# Altium project AudioEqualizer.PrjPcb
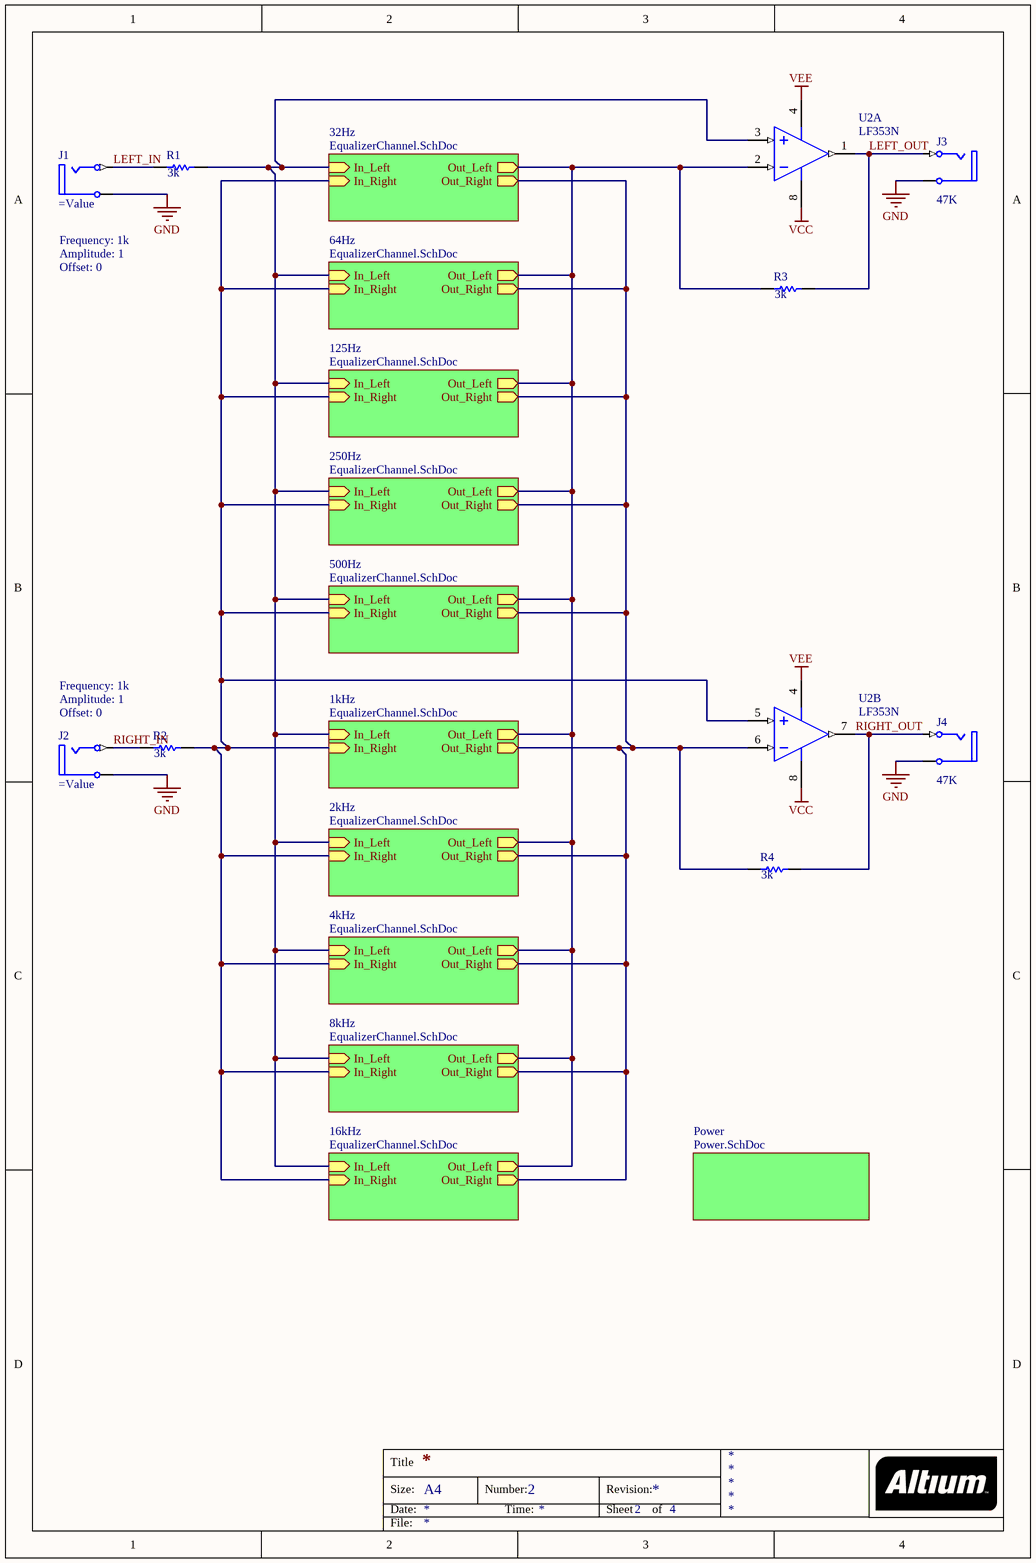
[diagram p0: EqualizerTop.SchDoc]
4 sheets, 139 parts. Net scope: hierarchical (ports join the sheet entries above them; power ports are global).
Sheets:
  EqualizerTop.SchDoc
    32Hz = EqualizerChannel.SchDoc
      Left = RCNetwork.SchDoc
      Right = RCNetwork.SchDoc
    64Hz = EqualizerChannel.SchDoc
      Left = RCNetwork.SchDoc
      Right = RCNetwork.SchDoc
    125Hz = EqualizerChannel.SchDoc
      Left = RCNetwork.SchDoc
      Right = RCNetwork.SchDoc
    250Hz = EqualizerChannel.SchDoc
      Left = RCNetwork.SchDoc
      Right = RCNetwork.SchDoc
    500Hz = EqualizerChannel.SchDoc
      Left = RCNetwork.SchDoc
      Right = RCNetwork.SchDoc
    1kHz = EqualizerChannel.SchDoc
      Left = RCNetwork.SchDoc
      Right = RCNetwork.SchDoc
    2kHz = EqualizerChannel.SchDoc
      Left = RCNetwork.SchDoc
      Right = RCNetwork.SchDoc
    4kHz = EqualizerChannel.SchDoc
      Left = RCNetwork.SchDoc
      Right = RCNetwork.SchDoc
    8kHz = EqualizerChannel.SchDoc
      Left = RCNetwork.SchDoc
      Right = RCNetwork.SchDoc
    16kHz = EqualizerChannel.SchDoc
      Left = RCNetwork.SchDoc
      Right = RCNetwork.SchDoc
    Power = Power.SchDoc

## Sheet EqualizerTop.SchDoc
size A4 portrait; DocumentNumber: 2; SheetNumber: 2; SheetTotal: 4

### Parts
J1  Offset: 0  Amplitude: 1  Frequency: 1k  [RCA/4.5-H2]
J2  Offset: 0  Amplitude: 1  Frequency: 1k  [RCA/4.5-H2]
J3  47K  [RCA/4.5-H2]
J4  47K  [RCA/4.5-H2]
R1  3k  [3216[1206]]
R2  3k  [3216[1206]]
R3  3k  [3216[1206]]
R4  3k  [3216[1206]]
U2  LF353N  [N08E]  (parts A,B of 2)

### Sub-sheets
1kHz = EqualizerChannel.SchDoc: In_Left (in), Out_Left (out), In_Right (in), Out_Right (out)  | C1_Value: 3.9nF; C2_Value: 0.22uF; R1_Value: 68k; R2_Value: 470; POT_SET: {SLIDER_1K}
2kHz = EqualizerChannel.SchDoc: In_Left (in), Out_Left (out), In_Right (in), Out_Right (out)  | C1_Value: 2nF; C2_Value: 0.1uF; R1_Value: 68k; R2_Value: 470; POT_SET: {SLIDER_2K}
4kHz = EqualizerChannel.SchDoc: In_Left (in), Out_Left (out), In_Right (in), Out_Right (out)  | C1_Value: 1.1nF; C2_Value: 0.056uF; R1_Value: 62k; R2_Value: 470; POT_SET: {SLIDER_4K}
8kHz = EqualizerChannel.SchDoc: In_Left (in), Out_Left (out), In_Right (in), Out_Right (out)  | C1_Value: 510pF; C2_Value: 0.022uF; R1_Value: 68k; R2_Value: 510; POT_SET: {SLIDER_8K}
16kHz = EqualizerChannel.SchDoc: In_Left (in), Out_Left (out), In_Right (in), Out_Right (out)  | C1_Value: 330pF; C2_Value: 0.012uF; R1_Value: 51k; R2_Value: 510; POT_SET: {SLIDER_16K}
32Hz = EqualizerChannel.SchDoc: In_Left (in), Out_Left (out), In_Right (in), Out_Right (out)  | C1_Value: 0.12uF; C2_Value: 4.7uF; R1_Value: 75k; R2_Value: 500; POT_SET: {SLIDER_32}
64Hz = EqualizerChannel.SchDoc: In_Left (in), Out_Left (out), In_Right (in), Out_Right (out)  | C1_Value: 0.056uF; C2_Value: 3.3uF; R1_Value: 68k; R2_Value: 510; POT_SET: {SLIDER_64}
125Hz = EqualizerChannel.SchDoc: In_Left (in), Out_Left (out), In_Right (in), Out_Right (out)  | C1_Value: 0.033uF; C2_Value: 1.5uF; R1_Value: 62k; R2_Value: 510; POT_SET: {SLIDER_125}
250Hz = EqualizerChannel.SchDoc: In_Left (in), Out_Left (out), In_Right (in), Out_Right (out)  | C1_Value: 0.015uF; C2_Value: 0.82uF; R1_Value: 68k; R2_Value: 470; POT_SET: {SLIDER_250}
500Hz = EqualizerChannel.SchDoc: In_Left (in), Out_Left (out), In_Right (in), Out_Right (out)  | C1_Value: 8.2nF; C2_Value: 0.39uF; R1_Value: 62k; R2_Value: 470; POT_SET: {SLIDER_500}
Power = Power.SchDoc: no entries

### Nets
GND: J1.1A(Ground) J2.1A(Ground) J3.1A(Ground) J4.1A(Ground)
VCC: U2.8(V+)
VEE: U2.4(V-)
LEFT_IN: J1.2B(Signal) R1.1
LEFT_OUT: J3.2B(Signal) R3.2 U2.1(OUTA)
RIGHT_IN: J2.2B(Signal) R2.1
RIGHT_OUT: J4.2B(Signal) R4.2 U2.7(OUTB)
NetR1_2: R1.2 U2.3(INA+) ; sheet 32Hz/In_Left, sheet 64Hz/In_Left, sheet 125Hz/In_Left, sheet 250Hz/In_Left, sheet 500Hz/In_Left, sheet 1kHz/In_Left, sheet 2kHz/In_Left, sheet 4kHz/In_Left, sheet 8kHz/In_Left, sheet 16kHz/In_Left
NetR2_2: R2.2 U2.5(INB+) ; sheet 32Hz/In_Right, sheet 64Hz/In_Right, sheet 125Hz/In_Right, sheet 250Hz/In_Right, sheet 500Hz/In_Right, sheet 1kHz/In_Right, sheet 2kHz/In_Right, sheet 4kHz/In_Right, sheet 8kHz/In_Right, sheet 16kHz/In_Right
NetR3_1: R3.1 U2.2(INA-) ; sheet 32Hz/Out_Left, sheet 64Hz/Out_Left, sheet 125Hz/Out_Left, sheet 250Hz/Out_Left, sheet 500Hz/Out_Left, sheet 1kHz/Out_Left, sheet 2kHz/Out_Left, sheet 4kHz/Out_Left, sheet 8kHz/Out_Left, sheet 16kHz/Out_Left
NetR4_1: R4.1 U2.6(INB-) ; sheet 32Hz/Out_Right, sheet 64Hz/Out_Right, sheet 125Hz/Out_Right, sheet 250Hz/Out_Right, sheet 500Hz/Out_Right, sheet 1kHz/Out_Right, sheet 2kHz/Out_Right, sheet 4kHz/Out_Right, sheet 8kHz/Out_Right, sheet 16kHz/Out_Right

### Notes on the sheet
- Title
- Size:
- Date:
- A4
- Number:
- Time:
- Revision:
- Sheet
- of
- File:

### Library data of the parts
J1-J4 = RCA: RCA Phono Jack, Right Angle, Thru-Hole, Snap-In; PCB_Layout: Complies with manufacturer's recommendation.; DrillAndSlotSize: Corresponds to nominal value.; Published: 15-Jul-2004; LatestRevisionDate: 15-Jul-2004; LatestRevisionNote: Component Replaced.; DatasheetDocument: 7-Jul-2000; PackageDocument: 7-Jul-2000; PackageReference: 161; Publisher: Altium Limited; ComponentLink1Description: Manufacturer Link; ComponentLink1URL: http://www.mouser.com/kobiconn/
  J3 J4: Value: 47K
R1-R4 = Res1: Resistor; Published: 8-Jun-2000; LatestRevisionDate: 17-Jul-2002; LatestRevisionNote: Re-released for DXP Platform.; Publisher: Altium Limited; Value: 3k
U2 = LF353N: Wide Bandwidth Dual JFET Input Operational Amplifier, 8-pin MDIP; Manufacturer: National Semiconductor; PackageTopMarking: NSUZXYTTE#*LF*353N; PowerWise: N; CompType: Amplifiers; Published: 4-Dec-2008; LatestRevisionDate: 13-Jan-2009; LatestRevisionNote: Sim Model Added.; PackageReference: N08E; Publisher: Altium Limited; ComponentLink1Description: LF353 Datasheet; ComponentLink1URL: http://www.national.com/ds/LF/LF353.pdf; ComponentLink2Description: LF353 Web Page; ComponentLink2URL: http://www.national.com/pf/LF/LF353.html; ComponentLink3Description: N08E Package Page; ComponentLink3URL: http://www.national.com/packaging/folders/n08e.html; DatasheetVersion: Dec-2003; PackageVersion: revG, May-2006; PackageDescription: MDIP, .365 x .250 x .130in, 8 Lead, .100in Pitch; Supplier 1: Farnell; Supplier Part Number 1: 9487034; PartNumber: LF353N; RoHS: N; PinCount: 8; Code_JEDEC: MS-001-BA

## Sheet EqualizerChannel.SchDoc
size A4; DocumentNumber: 1; SheetNumber: 1; SheetTotal: 4
Used 10 times, as channels 32Hz, 64Hz, 125Hz, 250Hz, 500Hz, 1kHz, 2kHz, 4kHz, 8kHz, 16kHz. Parts and nets are listed once, with the designators drawn on the sheet.
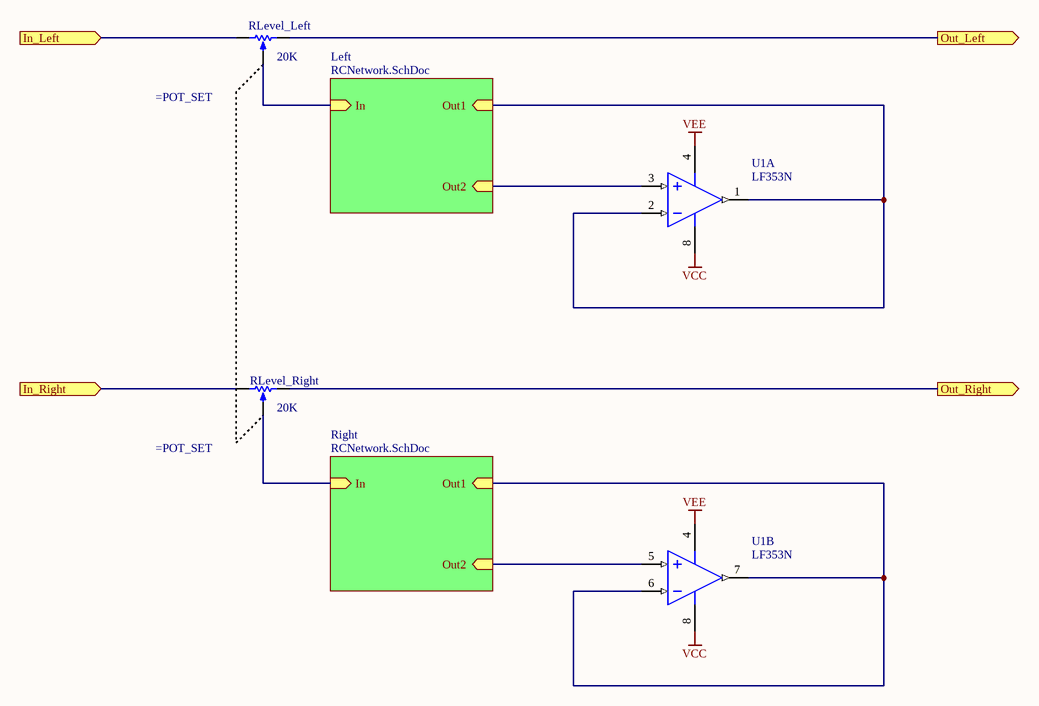
[diagram p1: EqualizerChannel.SchDoc]

### Parts
RLevel_Left  value 20K  [VR5]  (hidden comment: RPot)
RLevel_Right  value 20K  [VR5]  (hidden comment: RPot)
U1  LF353N  [N08E]  (parts A,B of 2)

### Sub-sheets
Left = RCNetwork.SchDoc: In (in), Out1 (in), Out2 (in)
Right = RCNetwork.SchDoc: In (in), Out1 (in), Out2 (in)

### Ports
In_Left (in), In_Right (in), Out_Left (out), Out_Right (out)

### Nets
VCC: U1.8(V+)
VEE: U1.4(V-)
In_Left: RLevel_Left.1(TOP) ; port In_Left
In_Right: RLevel_Right.1(TOP) ; port In_Right
Out_Left: RLevel_Left.2(BOT) ; port Out_Left
Out_Right: RLevel_Right.2(BOT) ; port Out_Right
NetRLevel_Left_3: RLevel_Left.3(TAP) ; sheet Left/In
NetRLevel_Right_3: RLevel_Right.3(TAP) ; sheet Right/In
NetU1_1: U1.1(OUTA) U1.2(INA-) ; sheet Left/Out1
NetU1_3: U1.3(INA+) ; sheet Left/Out2
NetU1_5: U1.5(INB+) ; sheet Right/Out2
NetU1_6: U1.6(INB-) U1.7(OUTB) ; sheet Right/Out1

### Channels
32Hz: designators end in _32Hz; ports In_Left=NetR1_2 In_Right=NetR2_2 Out_Left=NetR3_1 Out_Right=NetR4_1
64Hz: designators end in _64Hz; ports In_Left=NetR1_2 In_Right=NetR2_2 Out_Left=NetR3_1 Out_Right=NetR4_1
125Hz: designators end in _125Hz; ports In_Left=NetR1_2 In_Right=NetR2_2 Out_Left=NetR3_1 Out_Right=NetR4_1
250Hz: designators end in _250Hz; ports In_Left=NetR1_2 In_Right=NetR2_2 Out_Left=NetR3_1 Out_Right=NetR4_1
500Hz: designators end in _500Hz; ports In_Left=NetR1_2 In_Right=NetR2_2 Out_Left=NetR3_1 Out_Right=NetR4_1
1kHz: designators end in _1kHz; ports In_Left=NetR1_2 In_Right=NetR2_2 Out_Left=NetR3_1 Out_Right=NetR4_1
2kHz: designators end in _2kHz; ports In_Left=NetR1_2 In_Right=NetR2_2 Out_Left=NetR3_1 Out_Right=NetR4_1
4kHz: designators end in _4kHz; ports In_Left=NetR1_2 In_Right=NetR2_2 Out_Left=NetR3_1 Out_Right=NetR4_1
8kHz: designators end in _8kHz; ports In_Left=NetR1_2 In_Right=NetR2_2 Out_Left=NetR3_1 Out_Right=NetR4_1
16kHz: designators end in _16kHz; ports In_Left=NetR1_2 In_Right=NetR2_2 Out_Left=NetR3_1 Out_Right=NetR4_1

### Notes on the sheet
- Title
- Size:
- Date:
- A4
- Number:
- Time:
- Revision:
- Sheet
- of
- File:

### Library data of the parts
RLevel_Left RLevel_Right = RPot: Potentiometer; Sim Note: Enter the Resistance value and the set point into parameter fields.; Published: 8-Jun-2000; LatestRevisionDate: 17-Jul-2002; LatestRevisionNote: Re-released for DXP Platform.; Publisher: Altium Limited; Set Position: =POT_SET
U1 = LF353N: as U2 on sheet EqualizerTop; Published: 4-Dec-2008; LatestRevisionDate: 13-Jan-2009; LatestRevisionNote: Sim Model Added.; PackageReference: N08E; Publisher: Altium Limited; ComponentLink1Description: LF353 Datasheet; ComponentLink1URL: http://www.national.com/ds/LF/LF353.pdf; ComponentLink2Description: LF353 Web Page; ComponentLink2URL: http://www.national.com/pf/LF/LF353.html; ComponentLink3Description: N08E Package Page; ComponentLink3URL: http://www.national.com/packaging/folders/n08e.html; DatasheetVersion: Dec-2003; PackageVersion: revG, May-2006; PackageDescription: MDIP, .365 x .250 x .130in, 8 Lead, .100in Pitch; Supplier 1: Farnell; Supplier Part Number 1: 9487034; PartNumber: LF353N; RoHS: N; PinCount: 8; Code_JEDEC: MS-001-BA

## Sheet RCNetwork.SchDoc
size A4; DocumentNumber: 3; SheetNumber: 3; SheetTotal: 4
Used 20 times, as channels 32Hz/Left, 32Hz/Right, 64Hz/Left, 64Hz/Right, 125Hz/Left, 125Hz/Right, 250Hz/Left, 250Hz/Right, 500Hz/Left, 500Hz/Right, 1kHz/Left, 1kHz/Right, 2kHz/Left, 2kHz/Right, 4kHz/Left, 4kHz/Right, 8kHz/Left, 8kHz/Right, 16kHz/Left, 16kHz/Right. Parts and nets are listed once, with the designators drawn on the sheet.
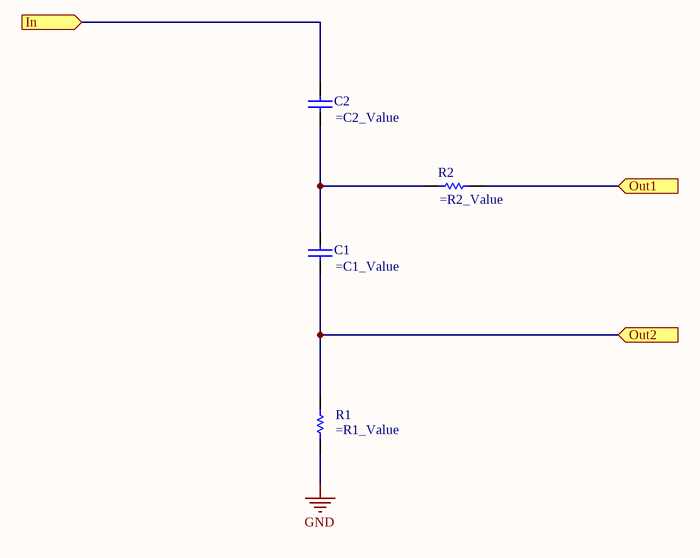
[diagram p2: RCNetwork.SchDoc]

### Parts
C1  (no value)  [C1206]
C2  (no value)  [C1206]
R1  (no value)  [3216[1206]]
R2  (no value)  [3216[1206]]

### Ports
In (in), Out1 (in), Out2 (in)

### Nets
GND: R1.1
In: C2.1 ; port In
Out1: R2.1 ; port Out1
Out2: C1.2 R1.2 ; port Out2
NetC1_1: C1.1 C2.2 R2.2

### Channels
32Hz/Left: designators end in _32Hz_Left; ports In=NetC2_32Hz_Left_1 Out1=NetR2_32Hz_Left_1 Out2=NetC1_32Hz_Left_2
32Hz/Right: designators end in _32Hz_Right; ports In=NetC2_32Hz_Right_1 Out1=NetR2_32Hz_Right_1 Out2=NetC1_32Hz_Right_2
64Hz/Left: designators end in _64Hz_Left; ports In=NetC2_64Hz_Left_1 Out1=NetR2_64Hz_Left_1 Out2=NetC1_64Hz_Left_2
64Hz/Right: designators end in _64Hz_Right; ports In=NetC2_64Hz_Right_1 Out1=NetR2_64Hz_Right_1 Out2=NetC1_64Hz_Right_2
125Hz/Left: designators end in _125Hz_Left; ports In=NetC2_125Hz_Left_1 Out1=NetR2_125Hz_Left_1 Out2=NetC1_125Hz_Left_2
125Hz/Right: designators end in _125Hz_Right; ports In=NetC2_125Hz_Right_1 Out1=NetR2_125Hz_Right_1 Out2=NetC1_125Hz_Right_2
250Hz/Left: designators end in _250Hz_Left; ports In=NetC2_250Hz_Left_1 Out1=NetR2_250Hz_Left_1 Out2=NetC1_250Hz_Left_2
250Hz/Right: designators end in _250Hz_Right; ports In=NetC2_250Hz_Right_1 Out1=NetR2_250Hz_Right_1 Out2=NetC1_250Hz_Right_2
500Hz/Left: designators end in _500Hz_Left; ports In=NetC2_500Hz_Left_1 Out1=NetR2_500Hz_Left_1 Out2=NetC1_500Hz_Left_2
500Hz/Right: designators end in _500Hz_Right; ports In=NetC2_500Hz_Right_1 Out1=NetR2_500Hz_Right_1 Out2=NetC1_500Hz_Right_2
1kHz/Left: designators end in _1kHz_Left; ports In=NetC2_1kHz_Left_1 Out1=NetR2_1kHz_Left_1 Out2=NetC1_1kHz_Left_2
1kHz/Right: designators end in _1kHz_Right; ports In=NetC2_1kHz_Right_1 Out1=NetR2_1kHz_Right_1 Out2=NetC1_1kHz_Right_2
2kHz/Left: designators end in _2kHz_Left; ports In=NetC2_2kHz_Left_1 Out1=NetR2_2kHz_Left_1 Out2=NetC1_2kHz_Left_2
2kHz/Right: designators end in _2kHz_Right; ports In=NetC2_2kHz_Right_1 Out1=NetR2_2kHz_Right_1 Out2=NetC1_2kHz_Right_2
4kHz/Left: designators end in _4kHz_Left; ports In=NetC2_4kHz_Left_1 Out1=NetR2_4kHz_Left_1 Out2=NetC1_4kHz_Left_2
4kHz/Right: designators end in _4kHz_Right; ports In=NetC2_4kHz_Right_1 Out1=NetR2_4kHz_Right_1 Out2=NetC1_4kHz_Right_2
8kHz/Left: designators end in _8kHz_Left; ports In=NetC2_8kHz_Left_1 Out1=NetR2_8kHz_Left_1 Out2=NetC1_8kHz_Left_2
8kHz/Right: designators end in _8kHz_Right; ports In=NetC2_8kHz_Right_1 Out1=NetR2_8kHz_Right_1 Out2=NetC1_8kHz_Right_2
16kHz/Left: designators end in _16kHz_Left; ports In=NetC2_16kHz_Left_1 Out1=NetR2_16kHz_Left_1 Out2=NetC1_16kHz_Left_2
16kHz/Right: designators end in _16kHz_Right; ports In=NetC2_16kHz_Right_1 Out1=NetR2_16kHz_Right_1 Out2=NetC1_16kHz_Right_2

### Notes on the sheet
- Title
- Size:
- Date:
- A4
- Number:
- Time:
- Revision:
- Sheet
- of
- File:

### Library data of the parts
C1 C2 = Cap: Capacitor; Published: 8-Jun-2000; LatestRevisionDate: 17-Jul-2002; LatestRevisionNote: Re-released for DXP Platform.; Publisher: Altium Limited
  C1: Value: =C1_Value
  C2: Value: =C2_Value
R1 R2 = Res1: Resistor; Published: 8-Jun-2000; LatestRevisionDate: 17-Jul-2002; LatestRevisionNote: Re-released for DXP Platform.; Publisher: Altium Limited
  R1: Value: =R1_Value
  R2: Value: =R2_Value

## Sheet Power.SchDoc
size A4; DocumentNumber: 4; SheetNumber: 4; SheetTotal: 4
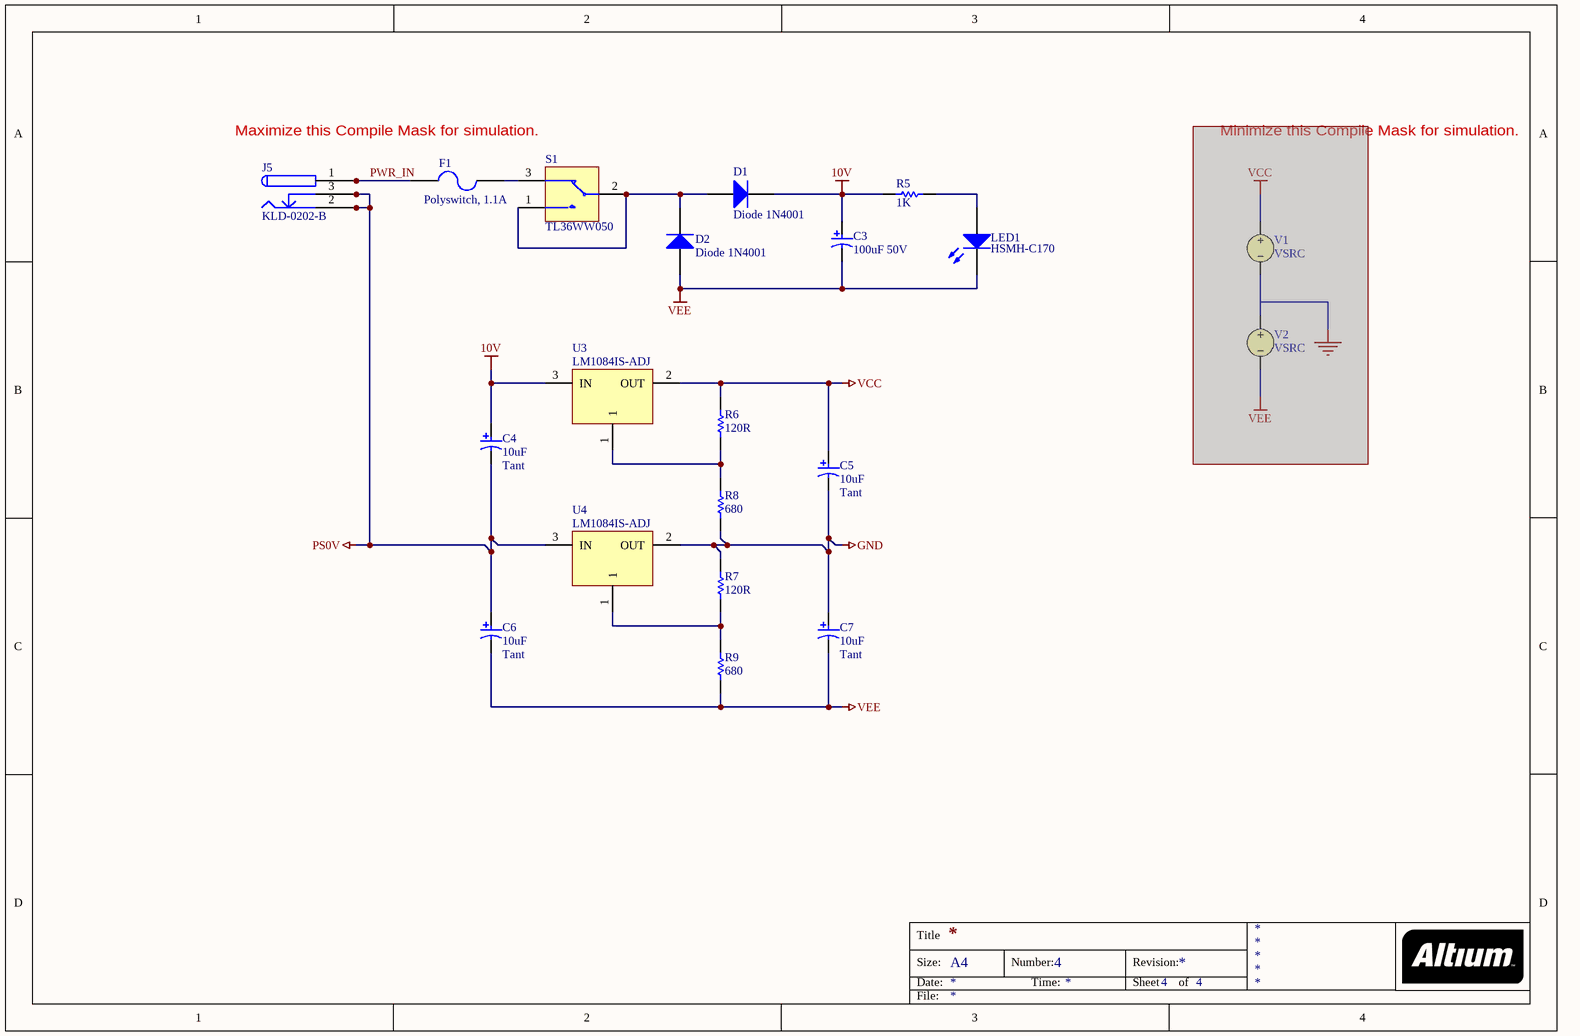
[diagram p3: Power.SchDoc]

### Parts
C3  100uF 50V  [MCCT-B]
C4  10uF  Capacitor Type: Tant  [MCCT-B]
C5  10uF  Capacitor Type: Tant  [MCCT-B]
C6  10uF  Capacitor Type: Tant  [MCCT-B]
C7  10uF  Capacitor Type: Tant  [MCCT-B]
D1  Diode 1N4001  [DO-41]
D2  Diode 1N4001  [DO-41]
F1  Polyswitch, 1.1A  [PIN-W2/E2.8]
J5  KLD-0202-B  [KLD-0202]
LED1  HSMH-C170  [SMD _LED]
R5  1K  [3216[1206]]
R6  120R  [3216[1206]]
R7  120R  [3216[1206]]
R8  680  [3216[1206]]
R9  680  [3216[1206]]
S1  TL36WW050  [B3FS_SWITCH]
U3  LM1084IS-ADJ  [TO-263]
U4  LM1084IS-ADJ  [TO-263]
V1  VSRC  (masked out: inside a compile mask, not in the netlist)
V2  VSRC  (masked out: inside a compile mask, not in the netlist)

### Nets
10V: C3.1 C4.1 D1.2(K) R5.2 U3.3(IN)
GND: C5.2 C7.1 R7.1 R8.2 U4.2(OUT)
PS0V: C4.2 C6.1 J5.2 J5.2A J5.2B J5.3 J5.3A J5.3B U4.3(IN)
VCC: C5.1 R6.1 U3.2(OUT)
VEE: C3.2 C6.2 C7.2 D2.1(A) LED1.2(K) R9.2
PWR_IN: F1.1 J5.1 J5.1A J5.1B
NetD1_1: D1.1(A) D2.2(K) S1.1 S1.2
NetF1_2: F1.2 S1.3
NetLED1_1: LED1.1(A) R5.1
NetR6_2: R6.2 R8.1 U3.1
NetR7_2: R7.2 R9.1 U4.1

### Notes on the sheet
- Maximize this Compile Mask for simulation.
- Minimize this Compile Mask for simulation.
- Title
- Size:
- Date:
- A4
- Number:
- Time:
- Revision:
- Sheet
- of
- File:

### Library data of the parts
C3 = CAP_POLAR: Polar Capacitor
C4-C7 = CAP_POLAR: Polar Capacitor; AEMS Code: 2100110; Supplier: FARNELL; Supplier Code: 967-117
D1 D2 = Diode 1N4001: 1 Amp General Purpose Rectifier; Published: 8-Jun-2000; LatestRevisionDate: 17-Jul-2002; LatestRevisionNote: Re-released for DXP Platform.; DatasheetVersion: 1998; PackageVersion: Aug-1999; PackageReference: DO-41; Publisher: Altium Limited; PackageDescription: Diode, Axial; Body 5.2 x 2.7 mm (LxDia. max), Lead Dia. 0.86 mm (max); Code_JEDEC: DO-204-AL; ComponentLink1Description: Manufacturer Link; ComponentLink1URL: http://www.fairchildsemi.com/; ComponentLink2Description: Datasheet; ComponentLink2URL: http://www.fairchildsemi.com/ds/1N%2F1N4001.pdf
F1 = Fuse 2: Polyswitch 1.1A, Raychem RUE110; Revision: July-2002: Re-released for DXP Platform.; Supplier: FARNELL; Supplier Code: 608-907
J5 = KLD-0202-B: Low Voltage Power Supply Connector; Manufacturer: Kycon; AEMS Code: 3510211
LED1 = HSMX-C670: Typical RED GaAs SMD LED Agilent make; AEMS Code: 2610081; Revision: July-2002: Re-released for DXP Platform.
R5 = RES: Resistor; AEMS Code: 1200430
R6-R9 = Res1: Resistor; Published: 8-Jun-2000; LatestRevisionDate: 17-Jul-2002; LatestRevisionNote: Re-released for DXP Platform.; Publisher: Altium Limited
  R6 R7: Value: 120R
  R8 R9: Value: 680
S1 = PCB_MOUNT_SWITCH: SPDT Subminiature Toggle Switch; Supplier: FARNELL; Supplier Code: 150-559
U3 U4 = LM1084IS-ADJ: 5A Low Dropout Possitive Regulators
V1 = VSRC: Voltage Source; Note: PCB Footprint - Not required; Value: 8V; Published: 8-Jun-2000; LatestRevisionDate: 17-Jul-2002; LatestRevisionNote: Re-released for DXP Platform.; PackageReference: Not Applicable; Publisher: Altium Limited
V2 = VSRC: Voltage Source; Note: PCB Footprint - Not required; Value: 8; Published: 8-Jun-2000; LatestRevisionDate: 17-Jul-2002; LatestRevisionNote: Re-released for DXP Platform.; PackageReference: Not Applicable; Publisher: Altium Limited

## Nets that join several sheets
GND: EqualizerTop (J1.1A J2.1A J3.1A J4.1A), 32Hz/Left (R1_32Hz_Left.1), 32Hz/Right (R1_32Hz_Right.1), 64Hz/Left (R1_64Hz_Left.1), 64Hz/Right (R1_64Hz_Right.1), 125Hz/Left (R1_125Hz_Left.1), 125Hz/Right (R1_125Hz_Right.1), 250Hz/Left (R1_250Hz_Left.1), 250Hz/Right (R1_250Hz_Right.1), 500Hz/Left (R1_500Hz_Left.1), 500Hz/Right (R1_500Hz_Right.1), 1kHz/Left (R1_1kHz_Left.1), 1kHz/Right (R1_1kHz_Right.1), 2kHz/Left (R1_2kHz_Left.1), 2kHz/Right (R1_2kHz_Right.1), 4kHz/Left (R1_4kHz_Left.1), 4kHz/Right (R1_4kHz_Right.1), 8kHz/Left (R1_8kHz_Left.1), 8kHz/Right (R1_8kHz_Right.1), 16kHz/Left (R1_16kHz_Left.1), 16kHz/Right (R1_16kHz_Right.1), Power (5 pins)
VCC: EqualizerTop (U2.8), 32Hz (U1_32Hz.8), 64Hz (U1_64Hz.8), 125Hz (U1_125Hz.8), 250Hz (U1_250Hz.8), 500Hz (U1_500Hz.8), 1kHz (U1_1kHz.8), 2kHz (U1_2kHz.8), 4kHz (U1_4kHz.8), 8kHz (U1_8kHz.8), 16kHz (U1_16kHz.8), Power (C5.1 R6.1 U3.2)
VEE: EqualizerTop (U2.4), 32Hz (U1_32Hz.4), 64Hz (U1_64Hz.4), 125Hz (U1_125Hz.4), 250Hz (U1_250Hz.4), 500Hz (U1_500Hz.4), 1kHz (U1_1kHz.4), 2kHz (U1_2kHz.4), 4kHz (U1_4kHz.4), 8kHz (U1_8kHz.4), 16kHz (U1_16kHz.4), Power (6 pins)
NetC1_1kHz_Left_2: 1kHz (U1_1kHz.3), 1kHz/Left (C1_1kHz_Left.2 R1_1kHz_Left.2)
NetC1_1kHz_Right_2: 1kHz (U1_1kHz.5), 1kHz/Right (C1_1kHz_Right.2 R1_1kHz_Right.2)
NetC1_2kHz_Left_2: 2kHz (U1_2kHz.3), 2kHz/Left (C1_2kHz_Left.2 R1_2kHz_Left.2)
NetC1_2kHz_Right_2: 2kHz (U1_2kHz.5), 2kHz/Right (C1_2kHz_Right.2 R1_2kHz_Right.2)
NetC1_4kHz_Left_2: 4kHz (U1_4kHz.3), 4kHz/Left (C1_4kHz_Left.2 R1_4kHz_Left.2)
NetC1_4kHz_Right_2: 4kHz (U1_4kHz.5), 4kHz/Right (C1_4kHz_Right.2 R1_4kHz_Right.2)
NetC1_8kHz_Left_2: 8kHz (U1_8kHz.3), 8kHz/Left (C1_8kHz_Left.2 R1_8kHz_Left.2)
NetC1_8kHz_Right_2: 8kHz (U1_8kHz.5), 8kHz/Right (C1_8kHz_Right.2 R1_8kHz_Right.2)
NetC1_16kHz_Left_2: 16kHz (U1_16kHz.3), 16kHz/Left (C1_16kHz_Left.2 R1_16kHz_Left.2)
NetC1_16kHz_Right_2: 16kHz (U1_16kHz.5), 16kHz/Right (C1_16kHz_Right.2 R1_16kHz_Right.2)
NetC1_32Hz_Left_2: 32Hz (U1_32Hz.3), 32Hz/Left (C1_32Hz_Left.2 R1_32Hz_Left.2)
NetC1_32Hz_Right_2: 32Hz (U1_32Hz.5), 32Hz/Right (C1_32Hz_Right.2 R1_32Hz_Right.2)
NetC1_64Hz_Left_2: 64Hz (U1_64Hz.3), 64Hz/Left (C1_64Hz_Left.2 R1_64Hz_Left.2)
NetC1_64Hz_Right_2: 64Hz (U1_64Hz.5), 64Hz/Right (C1_64Hz_Right.2 R1_64Hz_Right.2)
NetC1_125Hz_Left_2: 125Hz (U1_125Hz.3), 125Hz/Left (C1_125Hz_Left.2 R1_125Hz_Left.2)
NetC1_125Hz_Right_2: 125Hz (U1_125Hz.5), 125Hz/Right (C1_125Hz_Right.2 R1_125Hz_Right.2)
NetC1_250Hz_Left_2: 250Hz (U1_250Hz.3), 250Hz/Left (C1_250Hz_Left.2 R1_250Hz_Left.2)
NetC1_250Hz_Right_2: 250Hz (U1_250Hz.5), 250Hz/Right (C1_250Hz_Right.2 R1_250Hz_Right.2)
NetC1_500Hz_Left_2: 500Hz (U1_500Hz.3), 500Hz/Left (C1_500Hz_Left.2 R1_500Hz_Left.2)
NetC1_500Hz_Right_2: 500Hz (U1_500Hz.5), 500Hz/Right (C1_500Hz_Right.2 R1_500Hz_Right.2)
NetC2_1kHz_Left_1: 1kHz (RLevel_Left_1kHz.3), 1kHz/Left (C2_1kHz_Left.1)
NetC2_1kHz_Right_1: 1kHz (RLevel_Right_1kHz.3), 1kHz/Right (C2_1kHz_Right.1)
NetC2_2kHz_Left_1: 2kHz (RLevel_Left_2kHz.3), 2kHz/Left (C2_2kHz_Left.1)
NetC2_2kHz_Right_1: 2kHz (RLevel_Right_2kHz.3), 2kHz/Right (C2_2kHz_Right.1)
NetC2_4kHz_Left_1: 4kHz (RLevel_Left_4kHz.3), 4kHz/Left (C2_4kHz_Left.1)
NetC2_4kHz_Right_1: 4kHz (RLevel_Right_4kHz.3), 4kHz/Right (C2_4kHz_Right.1)
NetC2_8kHz_Left_1: 8kHz (RLevel_Left_8kHz.3), 8kHz/Left (C2_8kHz_Left.1)
NetC2_8kHz_Right_1: 8kHz (RLevel_Right_8kHz.3), 8kHz/Right (C2_8kHz_Right.1)
NetC2_16kHz_Left_1: 16kHz (RLevel_Left_16kHz.3), 16kHz/Left (C2_16kHz_Left.1)
NetC2_16kHz_Right_1: 16kHz (RLevel_Right_16kHz.3), 16kHz/Right (C2_16kHz_Right.1)
NetC2_32Hz_Left_1: 32Hz (RLevel_Left_32Hz.3), 32Hz/Left (C2_32Hz_Left.1)
NetC2_32Hz_Right_1: 32Hz (RLevel_Right_32Hz.3), 32Hz/Right (C2_32Hz_Right.1)
NetC2_64Hz_Left_1: 64Hz (RLevel_Left_64Hz.3), 64Hz/Left (C2_64Hz_Left.1)
NetC2_64Hz_Right_1: 64Hz (RLevel_Right_64Hz.3), 64Hz/Right (C2_64Hz_Right.1)
NetC2_125Hz_Left_1: 125Hz (RLevel_Left_125Hz.3), 125Hz/Left (C2_125Hz_Left.1)
NetC2_125Hz_Right_1: 125Hz (RLevel_Right_125Hz.3), 125Hz/Right (C2_125Hz_Right.1)
NetC2_250Hz_Left_1: 250Hz (RLevel_Left_250Hz.3), 250Hz/Left (C2_250Hz_Left.1)
NetC2_250Hz_Right_1: 250Hz (RLevel_Right_250Hz.3), 250Hz/Right (C2_250Hz_Right.1)
NetC2_500Hz_Left_1: 500Hz (RLevel_Left_500Hz.3), 500Hz/Left (C2_500Hz_Left.1)
NetC2_500Hz_Right_1: 500Hz (RLevel_Right_500Hz.3), 500Hz/Right (C2_500Hz_Right.1)
NetR1_2: EqualizerTop (R1.2 U2.3), 32Hz (RLevel_Left_32Hz.1), 64Hz (RLevel_Left_64Hz.1), 125Hz (RLevel_Left_125Hz.1), 250Hz (RLevel_Left_250Hz.1), 500Hz (RLevel_Left_500Hz.1), 1kHz (RLevel_Left_1kHz.1), 2kHz (RLevel_Left_2kHz.1), 4kHz (RLevel_Left_4kHz.1), 8kHz (RLevel_Left_8kHz.1), 16kHz (RLevel_Left_16kHz.1)
NetR2_1kHz_Left_1: 1kHz (U1_1kHz.1 U1_1kHz.2), 1kHz/Left (R2_1kHz_Left.1)
NetR2_1kHz_Right_1: 1kHz (U1_1kHz.6 U1_1kHz.7), 1kHz/Right (R2_1kHz_Right.1)
NetR2_2: EqualizerTop (R2.2 U2.5), 32Hz (RLevel_Right_32Hz.1), 64Hz (RLevel_Right_64Hz.1), 125Hz (RLevel_Right_125Hz.1), 250Hz (RLevel_Right_250Hz.1), 500Hz (RLevel_Right_500Hz.1), 1kHz (RLevel_Right_1kHz.1), 2kHz (RLevel_Right_2kHz.1), 4kHz (RLevel_Right_4kHz.1), 8kHz (RLevel_Right_8kHz.1), 16kHz (RLevel_Right_16kHz.1)
NetR2_2kHz_Left_1: 2kHz (U1_2kHz.1 U1_2kHz.2), 2kHz/Left (R2_2kHz_Left.1)
NetR2_2kHz_Right_1: 2kHz (U1_2kHz.6 U1_2kHz.7), 2kHz/Right (R2_2kHz_Right.1)
NetR2_4kHz_Left_1: 4kHz (U1_4kHz.1 U1_4kHz.2), 4kHz/Left (R2_4kHz_Left.1)
NetR2_4kHz_Right_1: 4kHz (U1_4kHz.6 U1_4kHz.7), 4kHz/Right (R2_4kHz_Right.1)
NetR2_8kHz_Left_1: 8kHz (U1_8kHz.1 U1_8kHz.2), 8kHz/Left (R2_8kHz_Left.1)
NetR2_8kHz_Right_1: 8kHz (U1_8kHz.6 U1_8kHz.7), 8kHz/Right (R2_8kHz_Right.1)
NetR2_16kHz_Left_1: 16kHz (U1_16kHz.1 U1_16kHz.2), 16kHz/Left (R2_16kHz_Left.1)
NetR2_16kHz_Right_1: 16kHz (U1_16kHz.6 U1_16kHz.7), 16kHz/Right (R2_16kHz_Right.1)
NetR2_32Hz_Left_1: 32Hz (U1_32Hz.1 U1_32Hz.2), 32Hz/Left (R2_32Hz_Left.1)
NetR2_32Hz_Right_1: 32Hz (U1_32Hz.6 U1_32Hz.7), 32Hz/Right (R2_32Hz_Right.1)
NetR2_64Hz_Left_1: 64Hz (U1_64Hz.1 U1_64Hz.2), 64Hz/Left (R2_64Hz_Left.1)
NetR2_64Hz_Right_1: 64Hz (U1_64Hz.6 U1_64Hz.7), 64Hz/Right (R2_64Hz_Right.1)
NetR2_125Hz_Left_1: 125Hz (U1_125Hz.1 U1_125Hz.2), 125Hz/Left (R2_125Hz_Left.1)
NetR2_125Hz_Right_1: 125Hz (U1_125Hz.6 U1_125Hz.7), 125Hz/Right (R2_125Hz_Right.1)
NetR2_250Hz_Left_1: 250Hz (U1_250Hz.1 U1_250Hz.2), 250Hz/Left (R2_250Hz_Left.1)
NetR2_250Hz_Right_1: 250Hz (U1_250Hz.6 U1_250Hz.7), 250Hz/Right (R2_250Hz_Right.1)
NetR2_500Hz_Left_1: 500Hz (U1_500Hz.1 U1_500Hz.2), 500Hz/Left (R2_500Hz_Left.1)
NetR2_500Hz_Right_1: 500Hz (U1_500Hz.6 U1_500Hz.7), 500Hz/Right (R2_500Hz_Right.1)
NetR3_1: EqualizerTop (R3.1 U2.2), 32Hz (RLevel_Left_32Hz.2), 64Hz (RLevel_Left_64Hz.2), 125Hz (RLevel_Left_125Hz.2), 250Hz (RLevel_Left_250Hz.2), 500Hz (RLevel_Left_500Hz.2), 1kHz (RLevel_Left_1kHz.2), 2kHz (RLevel_Left_2kHz.2), 4kHz (RLevel_Left_4kHz.2), 8kHz (RLevel_Left_8kHz.2), 16kHz (RLevel_Left_16kHz.2)
NetR4_1: EqualizerTop (R4.1 U2.6), 32Hz (RLevel_Right_32Hz.2), 64Hz (RLevel_Right_64Hz.2), 125Hz (RLevel_Right_125Hz.2), 250Hz (RLevel_Right_250Hz.2), 500Hz (RLevel_Right_500Hz.2), 1kHz (RLevel_Right_1kHz.2), 2kHz (RLevel_Right_2kHz.2), 4kHz (RLevel_Right_4kHz.2), 8kHz (RLevel_Right_8kHz.2), 16kHz (RLevel_Right_16kHz.2)